# Altium schematic sheet led_pack12_touch.SchDoc
size A4
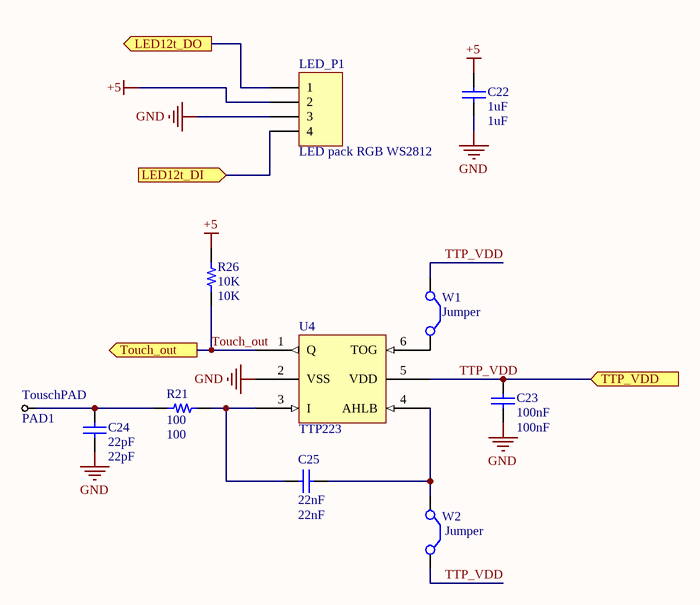
[diagram p0: led_pack12_touch.SchDoc]

## Parts
C22  1uF  [0603C]
C23  100nF  [0603C]
C24  22pF  [0603C]
C25  22nF  [0603C]
LED_P1  LED pack RGB WS2812  [PACK124-2121-2]
PAD1  TouschPAD  [touchpad6]  (no BOM)
R21  100  [0603R]
R26  10K  [0603R]
U4  TTP223  [SOT23-6_L]
W1  Jumper  [JUMPER]  (no BOM)
W2  Jumper  [JUMPER]  (no BOM)

## Ports
LED12t_DI (in), LED12t_DO (out), Touch_out (out), TTP_VDD (in)

## Nets
+5: C22.2 LED_P1.2 R26.1
GND: C22.1 C23.1 C24.1 LED_P1.3 U4.2(VSS)
LED12t_DI: LED_P1.4 ; port LED12t_DI
LED12t_DO: LED_P1.1 ; port LED12t_DO
Touch_out: R26.2 U4.1(Q) ; port Touch_out
TTP_VDD: C23.2 U4.5(VDD) W1.1(C1) W2.2(C2) ; port TTP_VDD
NetC24_2: C24.2 PAD1.1(T) R21.2
NetC25_1: C25.1 U4.4(AHLB) W2.1(C1)
NetC25_2: C25.2 R21.1 U4.3(I)
NetU4_6: U4.6(TOG) W1.2(C2)

## Library data of the parts
C22 C23 = Cap: CAP SMD 0603; Published: 8-Jun-2000; LatestRevisionDate: 17-Jul-2002; LatestRevisionNote: Re-released for DXP Platform.; PackageReference: RAD-0.3; Publisher: Altium Limited; PackageDescription: Radial Cap, Thru-Hole; 2 Leads; 0.3 in Pin Spacing
  C22: Value: 1uF
  C23: Value: 100nF
C24 C25 = Cap: X7R_NPO; Published: 8-Jun-2000; LatestRevisionDate: 17-Jul-2002; LatestRevisionNote: Re-released for DXP Platform.; PackageReference: RAD-0.3; Publisher: Altium Limited; PackageDescription: Radial Cap, Thru-Hole; 2 Leads; 0.3 in Pin Spacing
  C24: Value: 22pF
  C25: Value: 22nF
LED_P1 = Header 4: 8 32mm RGB LED pack; LatestRevisionDate: 17-Jul-2002; LatestRevisionNote: Re-released for DXP Platform.; Publisher: Altium Limited
PAD1 = Test Point
R21 R26 = Resistor: RES SMD 0603; Part Number: RCS0805100KFKEA
  R21: Value: 100
  R26: Value: 10K
U4 = ttp223b: capacitive touch IC
W1 W2 = Jumper: Jumper Wire; Published: 24-Mar-1999; LatestRevisionDate: 17-Jul-2002; LatestRevisionNote: Re-released for DXP Platform.; PackageReference: RAD-0.2; Publisher: Altium Limited; PackageDescription: Radial Cap, Thru-Hole; 2 Leads; 0.2 in Pin Spacing